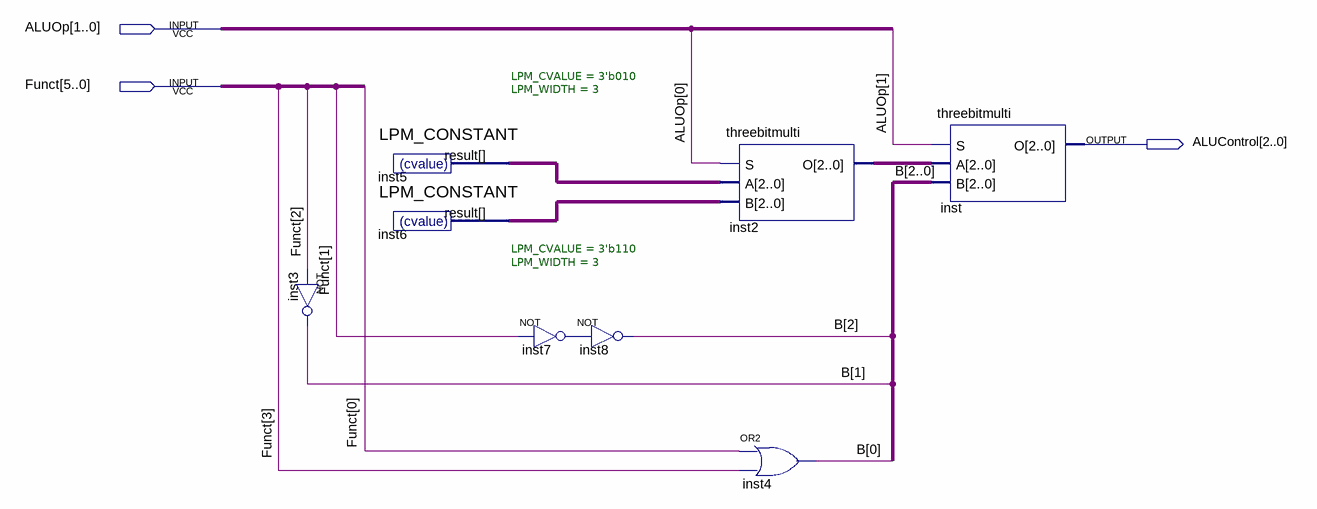
[diagram p0: schematic sheet]
// Quartus schematic aludecoder.bdf as structural Verilog: 8 symbols, 3 pins
module aludecoder (
  input  [1:0] ALUOp,
  input  [5:0] Funct,
  output [2:0] ALUControl
);

  wire inst7_out;
  wire [2:0] B, inst2_o, inst5_result, inst6_result;

  not inst3 (B[1], Funct[2]);
  LPM_CONSTANT #(.LPM_CVALUE(3'b010), .LPM_WIDTH(3)) inst5 (.result(inst5_result));
  LPM_CONSTANT #(.LPM_CVALUE(3'b110), .LPM_WIDTH(3)) inst6 (.result(inst6_result));
  not inst7 (inst7_out, Funct[1]);
  not inst8 (B[2], inst7_out);
  threebitmulti inst2 (.S(ALUOp[0]), .A(inst5_result), .B(inst6_result), .O(inst2_o));
  or inst4 (B[0], Funct[0], Funct[3]);
  threebitmulti inst (.S(ALUOp[1]), .A(inst2_o), .B(B), .O(ALUControl));
endmodule
